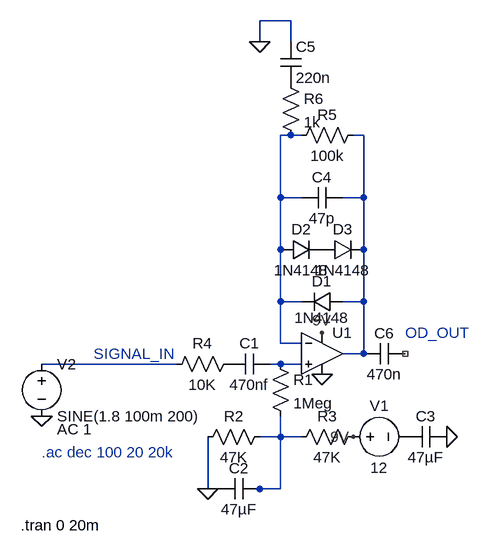
[diagram p0: schematic final over drive.asc]
final over drive.asc, the LTspice schematic file:
Version 4.1
SHEET 1 880 680
WIRE 128 -352 80 -352
WIRE 80 -320 80 -352
WIRE 128 -320 128 -352
WIRE 128 -176 112 -176
WIRE 144 -176 128 -176
WIRE 240 -176 224 -176
WIRE 112 -80 112 -176
WIRE 144 -80 112 -80
WIRE 240 -80 240 -176
WIRE 240 -80 208 -80
WIRE 112 0 112 -80
WIRE 240 0 240 -80
WIRE 112 80 112 0
WIRE 144 80 112 80
WIRE 240 80 240 0
WIRE 240 80 208 80
WIRE 112 144 112 80
WIRE 144 144 112 144
WIRE 240 160 240 80
WIRE 240 160 208 160
WIRE -48 176 -256 176
WIRE 112 176 96 176
WIRE 144 176 112 176
WIRE 112 288 112 256
WIRE 112 288 80 288
WIRE 144 288 112 288
WIRE 0 368 0 288
WIRE 16 368 0 368
WIRE 80 368 64 368
WIRE 112 368 112 288
WIRE 112 368 80 368
FLAG 0 368 0
FLAG 368 288 0
FLAG 80 -320 0
FLAG -256 256 0
FLAG 224 288 9V
FLAG 176 128 9V
FLAG 176 192 0
SYMBOL OpAmps\\UniversalOpAmp1 176 160 R0
SYMATTR InstName U1
SYMBOL cap 96 160 R90
WINDOW 0 0 32 VBottom 2
WINDOW 3 32 32 VTop 2
SYMATTR InstName C1
SYMATTR Value 470nf
SYMBOL res 96 160 R0
SYMATTR InstName R1
SYMATTR Value 1Meg
SYMBOL res 96 272 R90
WINDOW 0 0 56 VBottom 2
WINDOW 3 32 56 VTop 2
SYMATTR InstName R2
SYMATTR Value 47K
SYMBOL res 240 272 R90
WINDOW 0 0 56 VBottom 2
WINDOW 3 32 56 VTop 2
SYMATTR InstName R3
SYMATTR Value 47K
SYMBOL cap 80 352 R90
WINDOW 0 0 32 VBottom 2
WINDOW 3 32 32 VTop 2
SYMATTR InstName C2
SYMATTR Value 47µF
SYMBOL res 48 160 R90
WINDOW 0 0 56 VBottom 2
WINDOW 3 32 56 VTop 2
SYMATTR InstName R4
SYMATTR Value 10K
SYMBOL voltage 208 288 R270
WINDOW 0 32 56 VTop 2
WINDOW 3 -32 56 VBottom 2
WINDOW 123 0 0 Left 0
WINDOW 39 0 0 Left 0
SYMATTR InstName V1
SYMATTR Value 12
SYMBOL cap 368 272 R90
WINDOW 0 0 32 VBottom 2
WINDOW 3 32 32 VTop 2
SYMATTR InstName C3
SYMATTR Value 47µF
SYMBOL diode 208 64 R90
WINDOW 0 0 32 VBottom 2
WINDOW 3 25 32 VTop 2
SYMATTR InstName D1
SYMATTR Value 1N4148
SYMBOL cap 208 -96 R90
WINDOW 0 0 32 VBottom 2
WINDOW 3 32 32 VTop 2
SYMATTR InstName C4
SYMATTR Value 47p
SYMBOL res 240 -192 R90
WINDOW 0 0 56 VBottom 2
WINDOW 3 32 56 VTop 2
SYMATTR InstName R5
SYMATTR Value 100k
SYMBOL res 112 -272 R0
SYMATTR InstName R6
SYMATTR Value 1k
SYMBOL cap 112 -320 R0
SYMATTR InstName C5
SYMATTR Value 220n
SYMBOL cap 304 144 R90
WINDOW 0 0 32 VBottom 2
WINDOW 3 32 32 VTop 2
SYMATTR InstName C6
SYMATTR Value 470n
SYMBOL voltage -256 160 R0
WINDOW 123 24 116 Left 2
WINDOW 39 0 0 Left 0
SYMATTR Value2 AC 1
SYMATTR InstName V2
SYMATTR Value SINE(1.8 100m 200)
SYMBOL diode 112 16 R270
WINDOW 0 32 32 VTop 2
WINDOW 3 0 32 VBottom 2
SYMATTR InstName D2
SYMATTR Value 1N4148
SYMBOL diode 176 16 R270
WINDOW 0 32 32 VTop 2
WINDOW 3 0 32 VBottom 2
SYMATTR InstName D3
SYMATTR Value 1N4148
TEXT -176 160 Left 2 ;SIGNAL_IN
TEXT 304 128 Left 2 ;OD_OUT
TEXT -288 424 Left 2 !.tran 0 20m
TEXT -256 312 Left 2 ;.ac dec 100 20 20k

The netlist it stands for:
* final over drive.asc
X§U1 N004 N001 9V 0 N002 level1 Avol=1Meg GBW=10Meg Vos=0 En=0 Enk=0 In=0 Ink=0 Rin=500Meg  ; pins In+ In- V+ V- OUT
C1 N004 P001 470nf
R1 N004 N005 1Meg
R2 N005 0 47K
R3 9V N005 47K
C2 N005 0 47µF
R4 P001 N003 10K
V1 9V P002 12
C3 0 P002 47µF
D1 N002 N001 1N4148
C4 N002 N001 47p
R5 N002 N001 100k
R6 P003 N001 1k
C5 0 P003 220n
C6 NC_01 N002 470n
V2 N003 0 SINE(1.8 100m 200) AC 1
D2 N001 P004 1N4148
D3 P004 N002 1N4148
.model D D
.lib standard.dio
* SIGNAL_IN
* OD_OUT
.tran 0 20m
* .ac dec 100 20 20k
.lib UniversalOpAmp1.lib
.backanno
.end